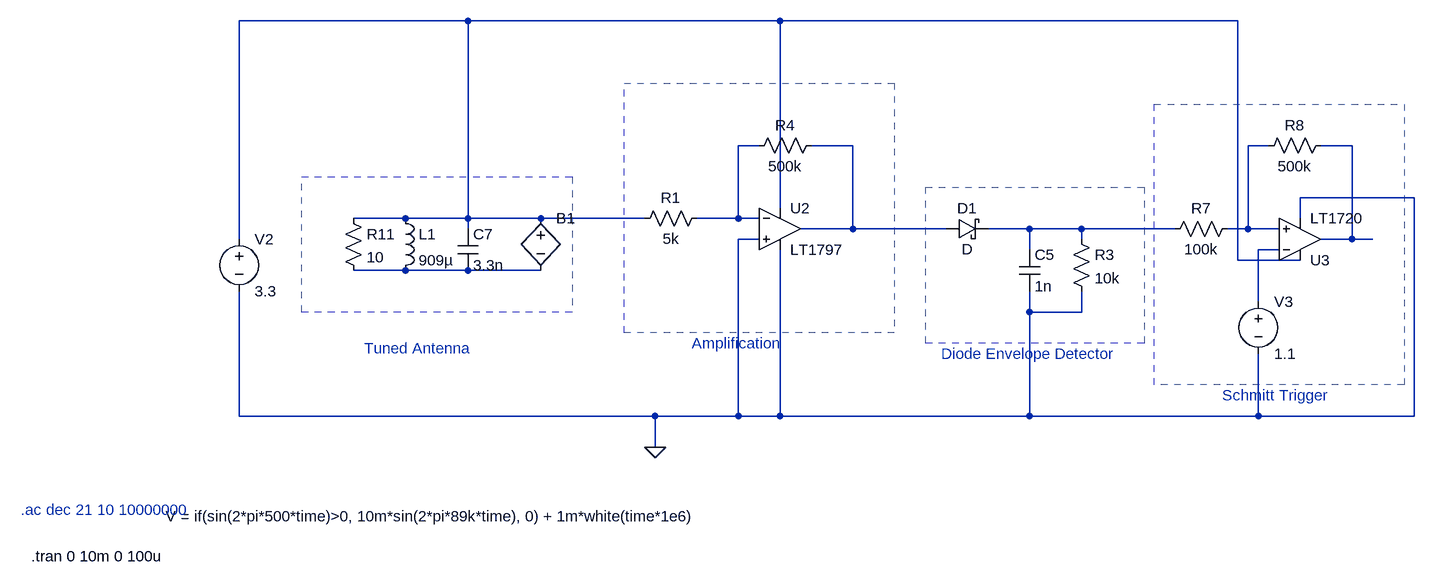
[diagram p0: schematic RF Sensor Final.asc]
RF Sensor Final.asc, the LTspice schematic file:
Version 4.1
SHEET 1 1124 680
WIRE -336 -224 -688 -224
WIRE 144 -224 -336 -224
WIRE 848 -224 144 -224
WIRE 112 -32 80 -32
WIRE 256 -32 192 -32
WIRE 896 -32 864 -32
WIRE 1024 -32 976 -32
WIRE 1120 48 944 48
WIRE 144 64 144 -224
WIRE -432 80 -512 80
WIRE -336 80 -336 -224
WIRE -336 80 -432 80
WIRE -224 80 -336 80
WIRE -64 80 -224 80
WIRE 80 80 80 -32
WIRE 80 80 16 80
WIRE 112 80 80 80
WIRE 944 80 944 48
WIRE -336 96 -336 80
WIRE 256 96 256 -32
WIRE 256 96 176 96
WIRE 400 96 256 96
WIRE 528 96 464 96
WIRE 608 96 528 96
WIRE 752 96 608 96
WIRE 864 96 864 -32
WIRE 864 96 832 96
WIRE 912 96 864 96
WIRE -688 112 -688 -224
WIRE 112 112 80 112
WIRE 608 112 608 96
WIRE 1024 112 1024 -32
WIRE 1024 112 976 112
WIRE 1056 112 1024 112
WIRE 528 128 528 96
WIRE 912 128 880 128
WIRE 848 144 848 -224
WIRE 944 144 848 144
WIRE -432 160 -512 160
WIRE -336 160 -432 160
WIRE -224 160 -336 160
WIRE 880 208 880 128
WIRE 528 224 528 192
WIRE 608 224 608 192
WIRE 608 224 528 224
WIRE -688 384 -688 192
WIRE -48 384 -688 384
WIRE 80 384 80 112
WIRE 80 384 -48 384
WIRE 144 384 144 128
WIRE 144 384 80 384
WIRE 528 384 528 224
WIRE 528 384 144 384
WIRE 880 384 880 288
WIRE 880 384 528 384
WIRE 1120 384 1120 48
WIRE 1120 384 880 384
WIRE -48 432 -48 384
FLAG -48 432 0
SYMBOL bv -224 64 R0
WINDOW 3 -577 474 Left 2
SYMATTR Value V = if(sin(2*pi*500*time)>0, 10m*sin(2*pi*89k*time), 0) + 1m*white(time*1e6)
SYMATTR InstName B1
SYMBOL voltage -688 96 R0
SYMATTR InstName V2
SYMATTR Value 3.3
SYMBOL OpAmps\\LT1797 144 32 R0
SYMATTR InstName U2
SYMBOL cap 512 128 R0
SYMATTR InstName C5
SYMATTR Value 1n
SYMBOL res 592 96 R0
SYMATTR InstName R3
SYMATTR Value 10k
SYMBOL schottky 400 112 R270
WINDOW 0 32 32 VTop 2
WINDOW 3 0 32 VBottom 2
SYMATTR InstName D1
SYMBOL res 208 -48 R90
WINDOW 0 0 56 VBottom 2
WINDOW 3 32 56 VTop 2
SYMATTR InstName R4
SYMATTR Value 500k
SYMBOL Comparators\\LT1720 944 176 M180
SYMATTR InstName U3
SYMBOL voltage 880 192 R0
WINDOW 123 0 0 Left 0
WINDOW 39 0 0 Left 0
SYMATTR InstName V3
SYMATTR Value 1.1
SYMBOL res 848 80 R90
WINDOW 0 0 56 VBottom 2
WINDOW 3 32 56 VTop 2
SYMATTR InstName R7
SYMATTR Value 100k
SYMBOL res 992 -48 R90
WINDOW 0 0 56 VBottom 2
WINDOW 3 32 56 VTop 2
SYMATTR InstName R8
SYMATTR Value 500k
SYMBOL cap -352 96 R0
SYMATTR InstName C7
SYMATTR Value 3.3n
SYMBOL ind -448 64 R0
SYMATTR InstName L1
SYMATTR Value 909µ
SYMBOL res -528 64 R0
SYMATTR InstName R11
SYMATTR Value 10
SYMBOL res 32 64 R90
WINDOW 0 0 56 VBottom 2
WINDOW 3 32 56 VTop 2
SYMATTR InstName R1
SYMATTR Value 5k
TEXT -1024 528 Left 2 ;.ac dec 21 10 10000000
TEXT -1008 600 Left 2 !.tran 0 10m 0 100u
TEXT -496 280 Left 2 ;Tuned Antenna
TEXT 392 288 Left 2 ;Diode Envelope Detector
TEXT 824 352 Left 2 ;Schmitt Trigger
TEXT 8 272 Left 2 ;Amplification
RECTANGLE Normal -176 224 -592 16 2
RECTANGLE Normal 704 272 368 32 2
RECTANGLE Normal 1104 336 720 -96 2
RECTANGLE Normal 320 256 -96 -128 2

The netlist it stands for:
* RF Sensor Final.asc
B1 N001 N008 V = if(sin(2*pi*500*time)>0, 10m*sin(2*pi*89k*time), 0) + 1m*white(time*1e6)
V2 N001 0 3.3
X§U2 0 N002 N001 0 N003 LT1797  ; pins In+ In- V+ V- OUT
C5 N006 0 1n
R3 N006 0 10k
D1 N003 N006 D
R4 N003 N002 500k
X§U3 N004 N007 N001 0 N005 LT1720  ; pins In+ In- V+ V- OUT
V3 N007 0 1.1
R7 N004 N006 100k
R8 N005 N004 500k
C7 N001 N008 3.3n
L1 N001 N008 909µ
R11 N001 N008 10
R1 N002 N001 5k
.model D D
.lib standard.dio
* .ac dec 21 10 10000000
.tran 0 10m 0 100u
* Tuned Antenna
* Diode Envelope Detector
* Schmitt Trigger
* Amplification
.lib LT1720.sub
.backanno
.end